# EAGLE design breadboard-small (EAGLE 6.5.0)
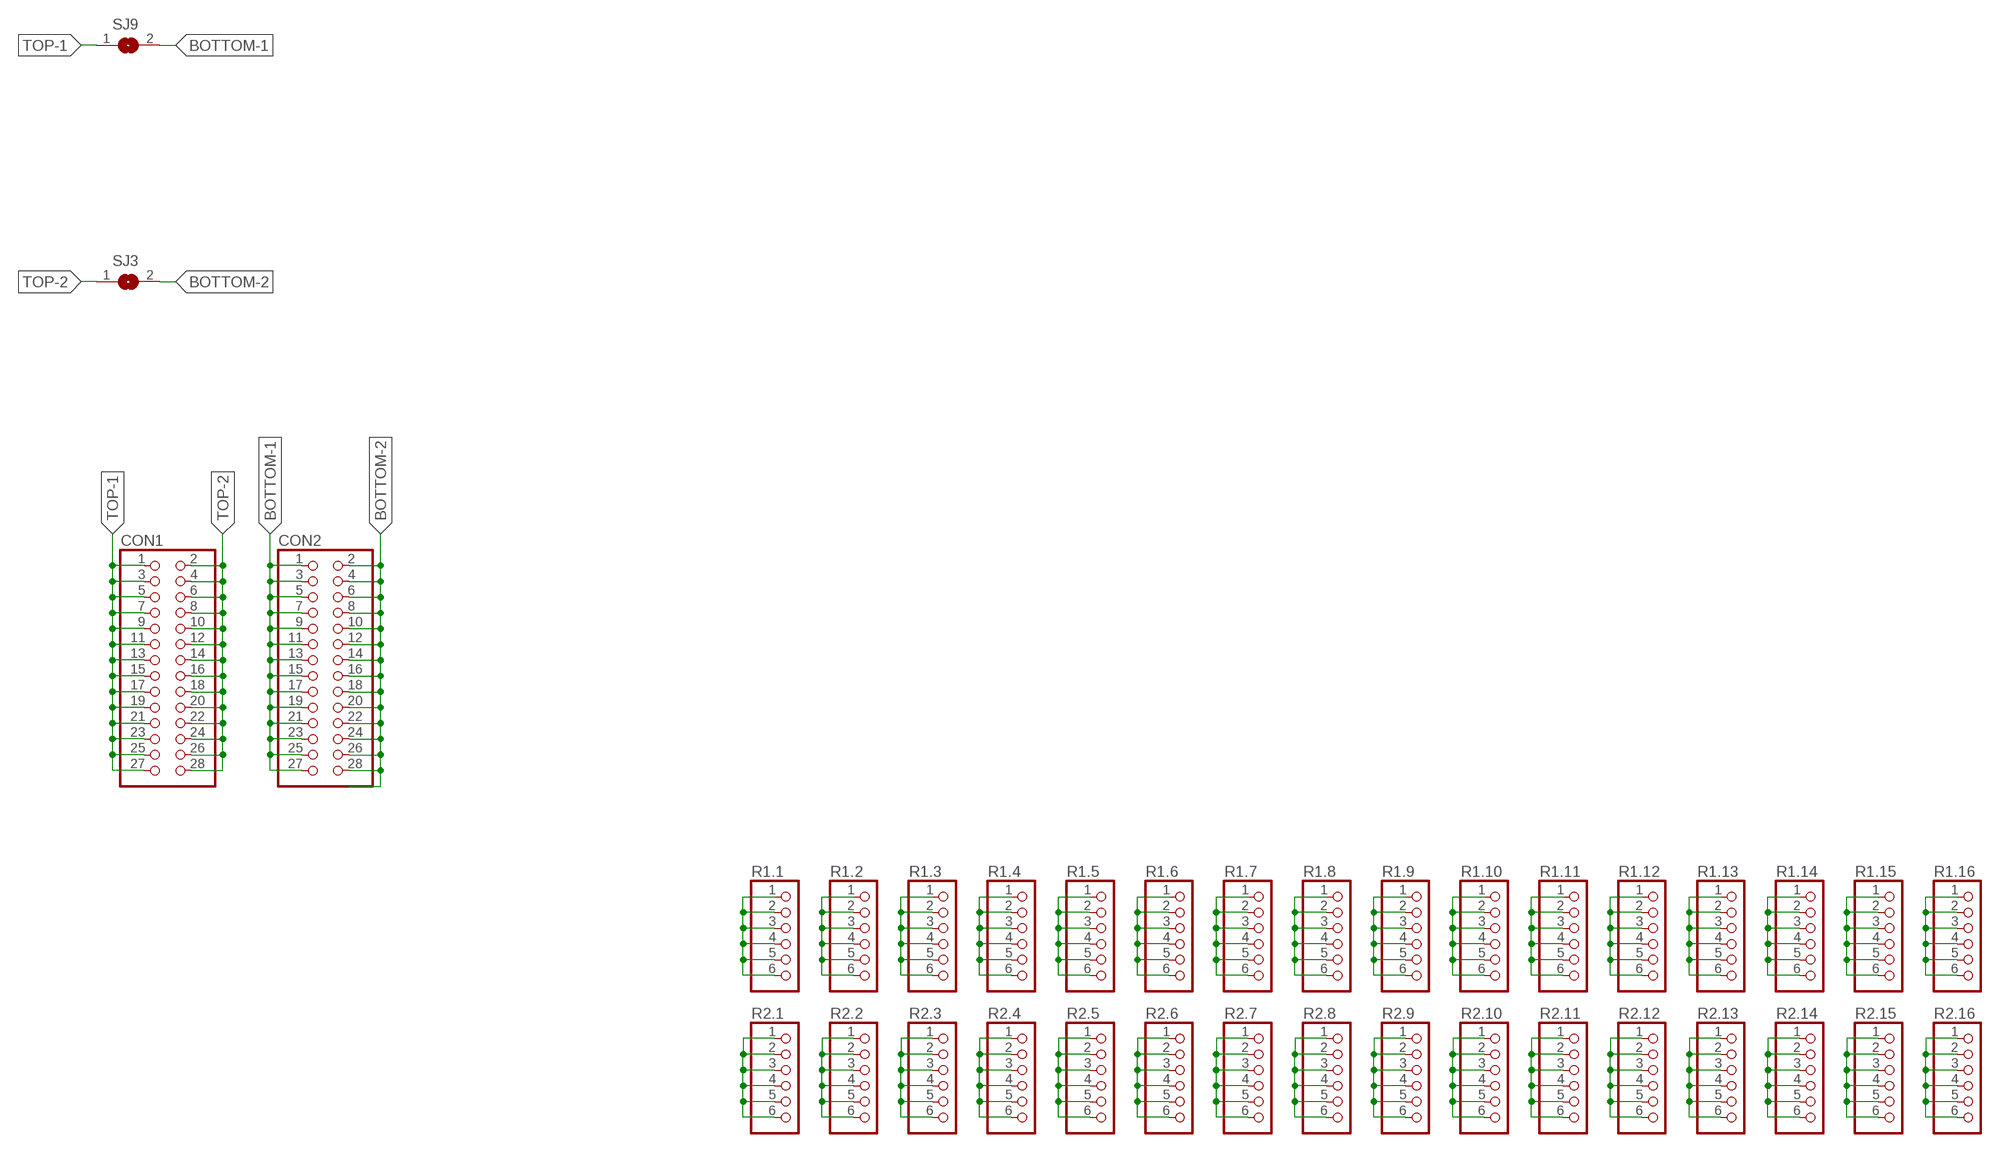
[diagram p0: schematic, sheet 1]

## Parts
CON1  GENERIC-2X14  [PINHEADER-100MIL-2X14-NOSILK]
CON2  GENERIC-2X14  [PINHEADER-100MIL-2X14-NOSILK]
R1.1  GENERIC-1X6  [PINHEADER-100MIL-1X6-NOSILK]
R1.2  GENERIC-1X6  [PINHEADER-100MIL-1X6-NOSILK]
R1.3  GENERIC-1X6  [PINHEADER-100MIL-1X6-NOSILK]
R1.4  GENERIC-1X6  [PINHEADER-100MIL-1X6-NOSILK]
R1.5  GENERIC-1X6  [PINHEADER-100MIL-1X6-NOSILK]
R1.6  GENERIC-1X6  [PINHEADER-100MIL-1X6-NOSILK]
R1.7  GENERIC-1X6  [PINHEADER-100MIL-1X6-NOSILK]
R1.8  GENERIC-1X6  [PINHEADER-100MIL-1X6-NOSILK]
R1.9  GENERIC-1X6  [PINHEADER-100MIL-1X6-NOSILK]
R1.10  GENERIC-1X6  [PINHEADER-100MIL-1X6-NOSILK]
R1.11  GENERIC-1X6  [PINHEADER-100MIL-1X6-NOSILK]
R1.12  GENERIC-1X6  [PINHEADER-100MIL-1X6-NOSILK]
R1.13  GENERIC-1X6  [PINHEADER-100MIL-1X6-NOSILK]
R1.14  GENERIC-1X6  [PINHEADER-100MIL-1X6-NOSILK]
R1.15  GENERIC-1X6  [PINHEADER-100MIL-1X6-NOSILK]
R1.16  GENERIC-1X6  [PINHEADER-100MIL-1X6-NOSILK]
R2.1  GENERIC-1X6  [PINHEADER-100MIL-1X6-NOSILK]
R2.2  GENERIC-1X6  [PINHEADER-100MIL-1X6-NOSILK]
R2.3  GENERIC-1X6  [PINHEADER-100MIL-1X6-NOSILK]
R2.4  GENERIC-1X6  [PINHEADER-100MIL-1X6-NOSILK]
R2.5  GENERIC-1X6  [PINHEADER-100MIL-1X6-NOSILK]
R2.6  GENERIC-1X6  [PINHEADER-100MIL-1X6-NOSILK]
R2.7  GENERIC-1X6  [PINHEADER-100MIL-1X6-NOSILK]
R2.8  GENERIC-1X6  [PINHEADER-100MIL-1X6-NOSILK]
R2.9  GENERIC-1X6  [PINHEADER-100MIL-1X6-NOSILK]
R2.10  GENERIC-1X6  [PINHEADER-100MIL-1X6-NOSILK]
R2.11  GENERIC-1X6  [PINHEADER-100MIL-1X6-NOSILK]
R2.12  GENERIC-1X6  [PINHEADER-100MIL-1X6-NOSILK]
R2.13  GENERIC-1X6  [PINHEADER-100MIL-1X6-NOSILK]
R2.14  GENERIC-1X6  [PINHEADER-100MIL-1X6-NOSILK]
R2.15  GENERIC-1X6  [PINHEADER-100MIL-1X6-NOSILK]
R2.16  GENERIC-1X6  [PINHEADER-100MIL-1X6-NOSILK]
SJ3  SJ  [SJ]
SJ9  SJ  [SJ]

## Nets
BOTTOM-1: CON2.1 CON2.3 CON2.5 CON2.7 CON2.9 CON2.11 CON2.13 CON2.15 CON2.17 CON2.19 CON2.21 CON2.23 CON2.25 CON2.27 SJ9.2
BOTTOM-2: CON2.2 CON2.4 CON2.6 CON2.8 CON2.10 CON2.12 CON2.14 CON2.16 CON2.18 CON2.20 CON2.22 CON2.24 CON2.26 CON2.28 SJ3.2
N$3: R2.6.1 R2.6.2 R2.6.3 R2.6.4 R2.6.5 R2.6.6
N$4: R1.6.1 R1.6.2 R1.6.3 R1.6.4 R1.6.5 R1.6.6
N$5: R2.7.1 R2.7.2 R2.7.3 R2.7.4 R2.7.5 R2.7.6
N$6: R1.7.1 R1.7.2 R1.7.3 R1.7.4 R1.7.5 R1.7.6
N$7: R2.8.1 R2.8.2 R2.8.3 R2.8.4 R2.8.5 R2.8.6
N$8: R1.8.1 R1.8.2 R1.8.3 R1.8.4 R1.8.5 R1.8.6
N$9: R2.9.1 R2.9.2 R2.9.3 R2.9.4 R2.9.5 R2.9.6
N$10: R2.1.1 R2.1.2 R2.1.3 R2.1.4 R2.1.5 R2.1.6
N$11: R1.1.1 R1.1.2 R1.1.3 R1.1.4 R1.1.5 R1.1.6
N$12: R2.3.1 R2.3.2 R2.3.3 R2.3.4 R2.3.5 R2.3.6
N$13: R2.2.1 R2.2.2 R2.2.3 R2.2.4 R2.2.5 R2.2.6
N$14: R1.2.1 R1.2.2 R1.2.3 R1.2.4 R1.2.5 R1.2.6
N$15: R1.3.1 R1.3.2 R1.3.3 R1.3.4 R1.3.5 R1.3.6
N$16: R2.4.1 R2.4.2 R2.4.3 R2.4.4 R2.4.5 R2.4.6
N$17: R1.4.1 R1.4.2 R1.4.3 R1.4.4 R1.4.5 R1.4.6
N$18: R2.5.1 R2.5.2 R2.5.3 R2.5.4 R2.5.5 R2.5.6
N$19: R1.5.1 R1.5.2 R1.5.3 R1.5.4 R1.5.5 R1.5.6
N$37: R1.9.1 R1.9.2 R1.9.3 R1.9.4 R1.9.5 R1.9.6
N$39: R2.10.1 R2.10.2 R2.10.3 R2.10.4 R2.10.5 R2.10.6
N$40: R1.10.1 R1.10.2 R1.10.3 R1.10.4 R1.10.5 R1.10.6
N$41: R2.11.1 R2.11.2 R2.11.3 R2.11.4 R2.11.5 R2.11.6
N$42: R1.11.1 R1.11.2 R1.11.3 R1.11.4 R1.11.5 R1.11.6
N$43: R2.12.1 R2.12.2 R2.12.3 R2.12.4 R2.12.5 R2.12.6
N$44: R1.12.1 R1.12.2 R1.12.3 R1.12.4 R1.12.5 R1.12.6
N$45: R2.13.1 R2.13.2 R2.13.3 R2.13.4 R2.13.5 R2.13.6
N$46: R1.13.1 R1.13.2 R1.13.3 R1.13.4 R1.13.5 R1.13.6
N$47: R2.14.1 R2.14.2 R2.14.3 R2.14.4 R2.14.5 R2.14.6
N$48: R1.14.1 R1.14.2 R1.14.3 R1.14.4 R1.14.5 R1.14.6
N$49: R2.15.1 R2.15.2 R2.15.3 R2.15.4 R2.15.5 R2.15.6
N$50: R1.15.1 R1.15.2 R1.15.3 R1.15.4 R1.15.5 R1.15.6
N$51: R2.16.1 R2.16.2 R2.16.3 R2.16.4 R2.16.5 R2.16.6
N$52: R1.16.1 R1.16.2 R1.16.3 R1.16.4 R1.16.5 R1.16.6
TOP-1: CON1.1 CON1.3 CON1.5 CON1.7 CON1.9 CON1.11 CON1.13 CON1.15 CON1.17 CON1.19 CON1.21 CON1.23 CON1.25 CON1.27 SJ9.1
TOP-2: CON1.2 CON1.4 CON1.6 CON1.8 CON1.10 CON1.12 CON1.14 CON1.16 CON1.18 CON1.20 CON1.22 CON1.24 CON1.26 CON1.28 SJ3.1

## Library data of the parts
CON1 CON2 = p.peter-connectors:GENERIC-2X14
R1.1-R1.16 R2.1-R2.16 = p.peter-connectors:GENERIC-1X6
SJ3 SJ9 = jumper:SJ: SMD solder JUMPER

## Board
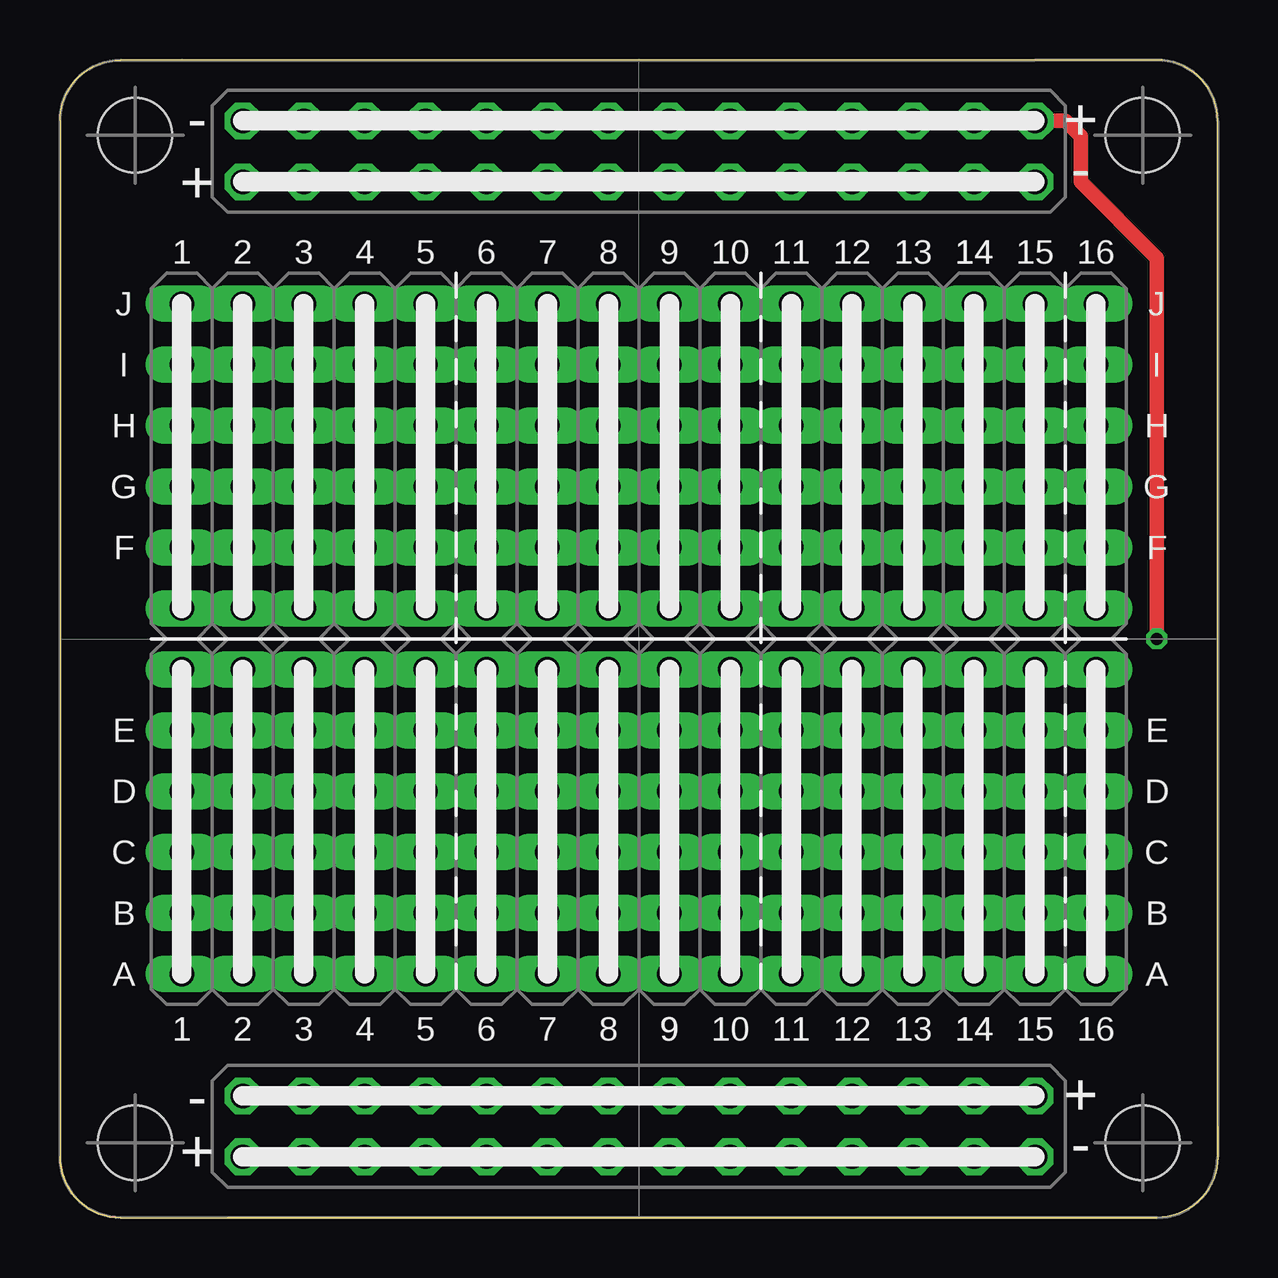
[diagram p1: board, top side]
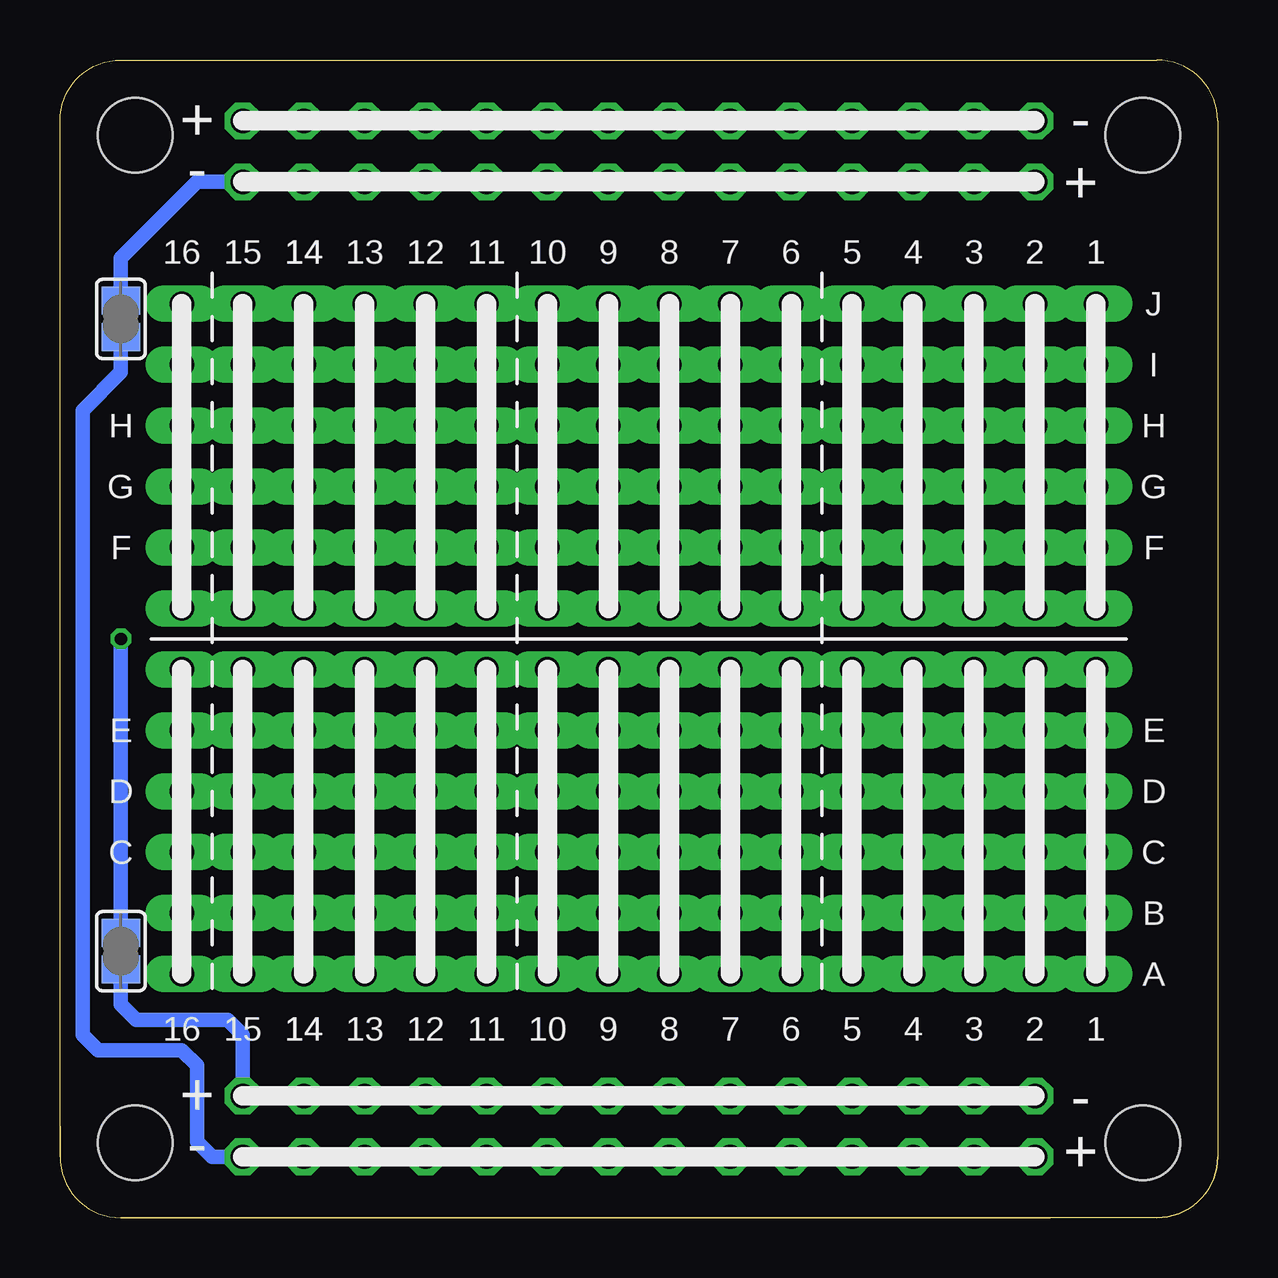
[diagram p2: board, bottom side, seen from below]

Size 48.26 x 48.26 mm. Coordinates in mm from the lower left corner, seen from the top.
Outline: 2.54,0 45.72,0
Outline: 48.26,2.54 48.26,45.72 arc90 45.72,48.26 2.54,48.26 arc90 0,45.72 0,2.54
Outline: 48.26,2.54 arc-90 45.72,0
Outline: 0,2.54 arc90 2.54,0
Outline: 2.54,0 6.99,0 43.81,0 45.72,0
Outline: 48.26,2.54 48.26,3.81 48.26,6.35
Outline: 48.26,2.54 arc-90 45.72,0
Outline: 2.54,0 arc-90 0,2.54
Copper layers (1*16): Top 0.0356mm / dielectric 1.5011mm / Bottom 0.0356mm
Design rules "breadboard": minimum track width 6mil, minimum drill 13mil, track to track 6mil, track to pad 6mil, pad to pad 6mil, via to via 6mil, smd to smd 6mil, copper to edge 15mil, drill to drill 6mil, minimum pad ring 8mil, minimum via ring 7mil, stop-mask expansion 4mil, vias tented up to drill 4.1mm, thermal gap 10mil
Holes 3.1 mm at 3.13,3.13 3.13,45.13 45.13,45.13 45.13,3.13

### Footprints (pad centres in the part's own frame; a part is rotated, then mirrored left to right if it is on the bottom)
PINHEADER-100MIL-2X14-NOSILK = drill 1.016 octagon: 1 -16.51,-1.27; 2 -16.51,1.27; 3 -13.97,-1.27; 4 -13.97,1.27; 5 -11.43,-1.27; 6 -11.43,1.27; 7 -8.89,-1.27; 8 -8.89,1.27; 9 -6.35,-1.27; 10 -6.35,1.27; 11 -3.81,-1.27; 12 -3.81,1.27; 13 -1.27,-1.27; 14 -1.27,1.27; 15 1.27,-1.27; 16 1.27,1.27; 17 3.81,-1.27; 18 3.81,1.27; 19 6.35,-1.27; 20 6.35,1.27; 21 8.89,-1.27; 22 8.89,1.27; 23 11.43,-1.27; 24 11.43,1.27; 25 13.97,-1.27; 26 13.97,1.27; 27 16.51,-1.27; 28 16.51,1.27
PINHEADER-100MIL-1X6-NOSILK = drill 1.016 long: 1 -6.35,0; 2 -3.81,0; 3 -1.27,0; 4 1.27,0; 5 3.81,0; 6 6.35,0
SJ = smd 1.168 x 1.6: 1 -0.762,0; 2 0.762,0

### Placement (x,y rotation side)
CON1  24.13,3.81 0 top
CON2  24.13,44.45 0 top
R1.1  5.08,31.75 90 top
R1.2  7.62,31.75 90 top
R1.3  10.16,31.75 90 top
R1.4  12.7,31.75 90 top
R1.5  15.24,31.75 90 top
R1.6  17.78,31.75 90 top
R1.7  20.32,31.75 90 top
R1.8  22.86,31.75 90 top
R1.9  25.4,31.75 90 top
R1.10  27.94,31.75 90 top
R1.11  30.48,31.75 90 top
R1.12  33.02,31.75 90 top
R1.13  35.56,31.75 90 top
R1.14  38.1,31.75 90 top
R1.15  40.64,31.75 90 top
R1.16  43.18,31.75 90 top
R2.1  5.08,16.51 90 top
R2.2  7.62,16.51 90 top
R2.3  10.16,16.51 90 top
R2.4  12.7,16.51 90 top
R2.5  15.24,16.51 90 top
R2.6  17.78,16.51 90 top
R2.7  20.32,16.51 90 top
R2.8  22.86,16.51 90 top
R2.9  25.4,16.51 90 top
R2.10  27.94,16.51 90 top
R2.11  30.48,16.51 90 top
R2.12  33.02,16.51 90 top
R2.13  35.56,16.51 90 top
R2.14  38.1,16.51 90 top
R2.15  40.64,16.51 90 top
R2.16  43.18,16.51 90 top
SJ3  45.72,11.11 90 bottom
SJ9  45.72,37.47 90 bottom
U$1  [OUTLINE-SOB-5X5-IMPERIAL]  0,0 0 top

### Tracks (layer width: path | path; a pad name or v marks a point on that pad's centre or on a via)
BOTTOM-1
  Bottom 0.61: SJ9.2 45.72,40.01 42.55,43.18 CON2.27
  Bottom 0.813: CON2.1 CON2.3 CON2.5 CON2.7 CON2.9 CON2.11 CON2.13 CON2.15 CON2.17 CON2.19 CON2.21 CON2.23 CON2.25 CON2.27
BOTTOM-2  (via drill 0.51)
  Top 0.61: v45.72,24.13 45.72,40.01 42.55,43.18 42.55,45.09 41.91,45.72 CON2.28
  Bottom 0.61: SJ3.2 45.72,13.34 v45.72,24.13
  Bottom 0.813: CON2.2 CON2.4 CON2.6 CON2.8 CON2.10 CON2.12 CON2.14 CON2.16 CON2.18 CON2.20 CON2.22 CON2.24 CON2.26 CON2.28
N$3
  Bottom 0.813: R2.6.6 R2.6.5 R2.6.4 R2.6.3 R2.6.2 R2.6.1
N$4
  Bottom 0.813: R1.6.6 R1.6.5 R1.6.4 R1.6.3 R1.6.2 R1.6.1
N$5
  Bottom 0.813: R2.7.6 R2.7.5 R2.7.4 R2.7.3 R2.7.2 R2.7.1
N$6
  Bottom 0.813: R1.7.6 R1.7.5 R1.7.4 R1.7.3 R1.7.2 R1.7.1
N$7
  Bottom 0.813: R2.8.6 R2.8.5 R2.8.4 R2.8.3 R2.8.2 R2.8.1
N$8
  Bottom 0.813: R1.8.6 R1.8.5 R1.8.4 R1.8.3 R1.8.2 R1.8.1
N$9
  Bottom 0.813: R2.9.6 R2.9.5 R2.9.4 R2.9.3 R2.9.2 R2.9.1
N$10
  Bottom 0.813: R2.1.6 R2.1.5 R2.1.4 R2.1.3 R2.1.2 R2.1.1
N$11
  Bottom 0.813: R1.1.6 R1.1.5 R1.1.4 R1.1.3 R1.1.2 R1.1.1
N$12
  Bottom 0.813: R2.3.6 R2.3.5 R2.3.4 R2.3.3 R2.3.2 R2.3.1
N$13
  Bottom 0.813: R2.2.6 R2.2.5 R2.2.4 R2.2.3 R2.2.2 R2.2.1
N$14
  Bottom 0.813: R1.2.6 R1.2.5 R1.2.4 R1.2.3 R1.2.2 R1.2.1
N$15
  Bottom 0.813: R1.3.6 R1.3.5 R1.3.4 R1.3.3 R1.3.2 R1.3.1
N$16
  Bottom 0.813: R2.4.6 R2.4.5 R2.4.4 R2.4.3 R2.4.2 R2.4.1
N$17
  Bottom 0.813: R1.4.6 R1.4.5 R1.4.4 R1.4.3 R1.4.2 R1.4.1
N$18
  Bottom 0.813: R2.5.6 R2.5.5 R2.5.4 R2.5.3 R2.5.2 R2.5.1
N$19
  Bottom 0.813: R1.5.6 R1.5.5 R1.5.4 R1.5.3 R1.5.2 R1.5.1
N$37
  Bottom 0.813: R1.9.6 R1.9.5 R1.9.4 R1.9.3 R1.9.2 R1.9.1
N$39
  Bottom 0.813: R2.10.6 R2.10.5 R2.10.4 R2.10.3 R2.10.2 R2.10.1
N$40
  Bottom 0.813: R1.10.6 R1.10.5 R1.10.4 R1.10.3 R1.10.2 R1.10.1
N$41
  Bottom 0.813: R2.11.6 R2.11.5 R2.11.4 R2.11.3 R2.11.2 R2.11.1
N$42
  Bottom 0.813: R1.11.6 R1.11.5 R1.11.4 R1.11.3 R1.11.2 R1.11.1
N$43
  Bottom 0.813: R2.12.6 R2.12.5 R2.12.4 R2.12.3 R2.12.2 R2.12.1
N$44
  Bottom 0.813: R1.12.6 R1.12.5 R1.12.4 R1.12.3 R1.12.2 R1.12.1
N$45
  Bottom 0.813: R2.13.6 R2.13.5 R2.13.4 R2.13.3 R2.13.2 R2.13.1
N$46
  Bottom 0.813: R1.13.6 R1.13.5 R1.13.4 R1.13.3 R1.13.2 R1.13.1
N$47
  Bottom 0.813: R2.14.6 R2.14.5 R2.14.4 R2.14.3 R2.14.2 R2.14.1
N$48
  Bottom 0.813: R1.14.6 R1.14.5 R1.14.4 R1.14.3 R1.14.2 R1.14.1
N$49
  Bottom 0.813: R2.15.6 R2.15.5 R2.15.4 R2.15.3 R2.15.2 R2.15.1
N$50
  Bottom 0.813: R1.15.6 R1.15.5 R1.15.4 R1.15.3 R1.15.2 R1.15.1
N$51
  Bottom 0.813: R2.16.6 R2.16.5 R2.16.4 R2.16.3 R2.16.2 R2.16.1
N$52
  Bottom 0.813: R1.16.6 R1.16.5 R1.16.4 R1.16.3 R1.16.2 R1.16.1
TOP-1
  Bottom 0.61: SJ9.1 45.72,35.24 47.31,33.66 47.31,7.62 46.67,6.99 43.18,6.99 42.55,6.35 42.55,3.17 41.91,2.54 CON1.27
  Bottom 0.813: CON1.1 CON1.3 CON1.5 CON1.7 CON1.9 CON1.11 CON1.13 CON1.15 CON1.17 CON1.19 CON1.21 CON1.23 CON1.25 CON1.27
TOP-2
  Bottom 0.61: SJ3.1 45.72,8.89 45.09,8.26 41.27,8.26 40.64,7.62 CON1.28
  Bottom 0.813: CON1.2 CON1.4 CON1.6 CON1.8 CON1.10 CON1.12 CON1.14 CON1.16 CON1.18 CON1.20 CON1.22 CON1.24 CON1.26 CON1.28

### Text on the board
tPlace: - | + | + | - | 1 | 2 | 3 | 4 | 5 | 6 | 7 | 8 | 9 | 10 | 11 | 12 | 13 | 14 | 14 | 15 | 16 | J | J | I | I | H | H | G | G | F | F | E | E | D | D | C | C | B | B | A | A | 1 | 2 | 3 | 4 | 5 | 6 | 7 | 8 | 9 | 9 | 10 | 11 | 12 | 13 | 14 | 14 | 15 | 16 | - | + | + | -
bPlace: - | + | + | - | 1 | 2 | 3 | 4 | 5 | 6 | 7 | 8 | 9 | 10 | 11 | 12 | 13 | 14 | 14 | 15 | 16 | J | I | H | H | G | G | F | F | E | E | D | D | C | C | B | A | 1 | 2 | 3 | 4 | 5 | 6 | 7 | 8 | 9 | 10 | 11 | 12 | 13 | 14 | 14 | 15 | 16 | - | + | + | -